# EAGLE design Power Dist Motor (EAGLE 7.2.0)
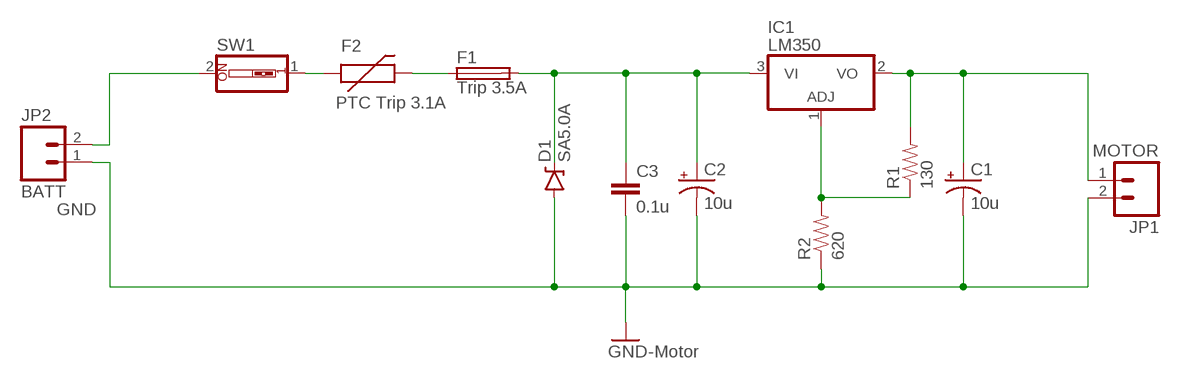
[diagram p0: schematic, sheet 1]

## Parts
C1  10u  CAP_POLPTH2  [CPOL-RADIAL-10UF-25V]
C2  10u  CAP_POLPTH2  [CPOL-RADIAL-10UF-25V]
C3  0.1u  CAPPTH  [CAP-PTH-SMALL]
D1  SA5.0A  DIODE-ZENER  [DIODE-BZT52]
F1  Trip 3.5A  PICOFUSE  [PICOFUSE]
F2  PTC Trip 3.1A  PTCPTH  [PTC]
IC1  LM350  317T  [TO220H]
JP1  MOTOR  M02PTH  [1X02]
JP2  BATT  M02PTH  [1X02]
R1  130  RESISTORPTH-1/4W  [AXIAL-0.4]
R2  620  RESISTORPTH-1/4W  [AXIAL-0.4]
SW1  SW_DIP-1  [EDG-01]

## Nets
GND: C1.2(-) C2.2(-) C3.2 D1.A JP1.2 JP2.1 R2.P$1 ; supply symbol labelled GND-Motor
N$1: C1.1(+) IC1.2(VO) JP1.1 R1.P$2
N$2: JP2.2 SW1.2
N$3: F2.P$1 SW1.1
N$4: IC1.1(ADJ) R1.P$1 R2.P$2
N$5: F1.1 F2.P$2
N$7: C2.1(+) C3.1 D1.C F1.2 IC1.3(VI)

## Library data of the parts
C1 C2 = SparkFun-Capacitors:CAP_POL: Capacitor Polarized These are standard SMD and PTH capacitors. Normally 10uF, 47uF, and 100uF in electrolytic and tantalum varieties. Always verify the external diameter of the through hole cap, it varies with capacity, voltage, and manufacturer. The EIA devices should be standard.
C3 = SparkFun-Capacitors:CAP: Capacitor Standard 0603 ceramic capacitor, and 0.1" leaded capacitor.
D1 = SparkFun-DiscreteSemi:DIODE-ZENER: Zener Diode Production Part - 8199 3.4V Zener Voltage; PROD-ID: DIO-08199; VALUE: BZT52
F1 = fuse:PICOFUSE: PICOFUSE 19275, Wickmann; OC_FARNELL: unknown; OC_NEWARK: unknown
F2 = SparkFun-PowerIC:PTC: Resettable Fuse PTC Resettable Fuse. Spark Fun Electronics SKU : COM-08357
IC1 = linear:*317: Positive VOLTAGE REGULATOR
JP1 JP2 = SparkFun-Connectors:M02: Standard 2-pin 0.1" header. Use with - straight break away headers ( PRT-00116) - right angle break away headers (PRT-00553) - swiss pins (PRT-00743) - machine pins (PRT-00117) - female headers (PRT-00115) Molex polarized connector foot print use with: PRT-08233 with associated crimp pins and housings. 2.54_SCREWTERM for use with PRT-10571. 3.5mm Screw Terminal footprints for PRT-08084 5mm Screw Terminal footprints for use with PRT-08432
R1 R2 = SparkFun-Passives:RESISTOR: Resistor Basic schematic elements and footprints for 0603, 1206, and PTH resistors.
SW1 = special:SW_DIP-1: DIP SWITCH

## Net classes
0 default: width 0.889 mm

## Board
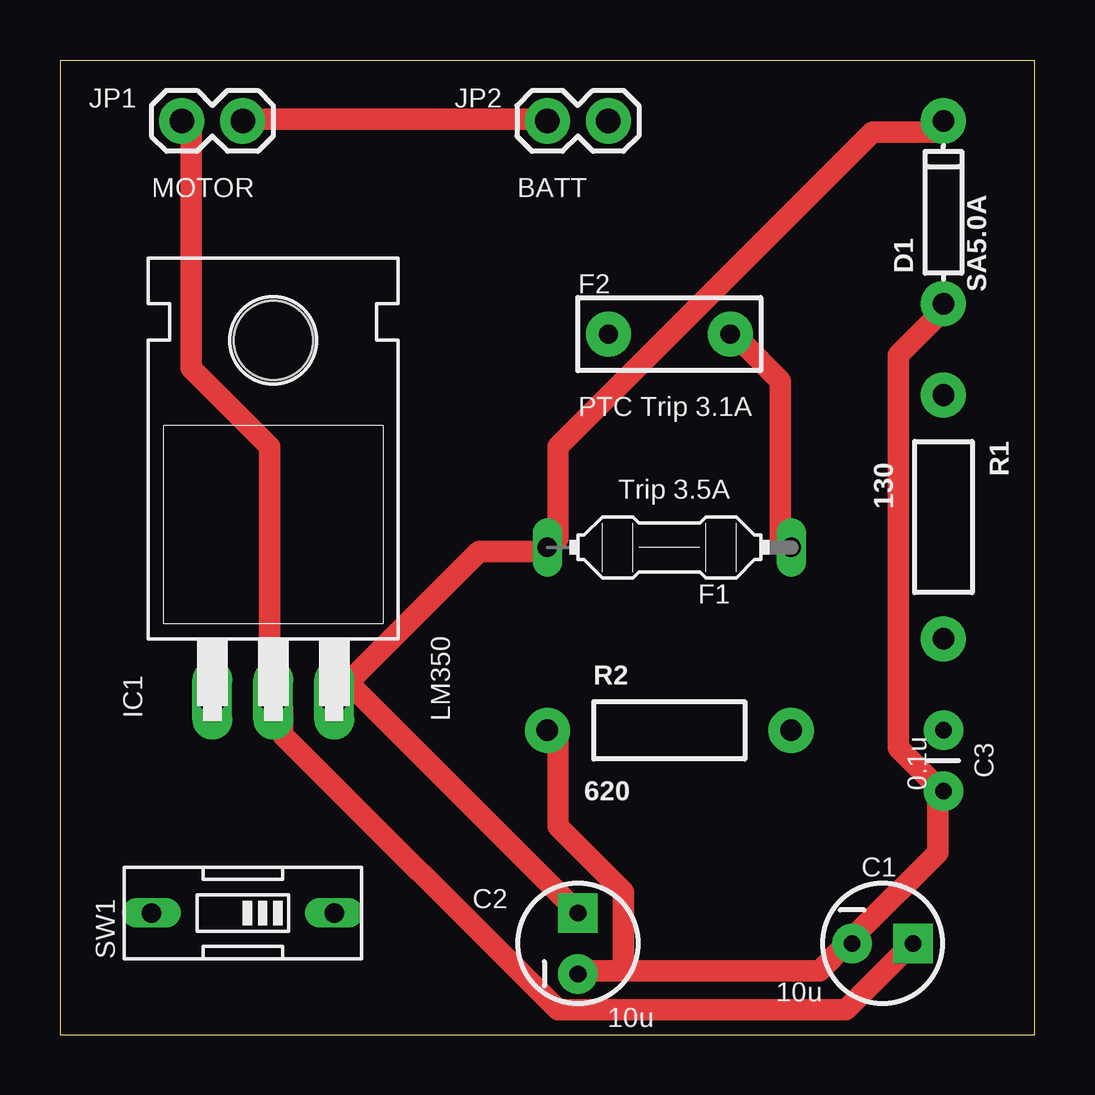
[diagram p1: board, top side]
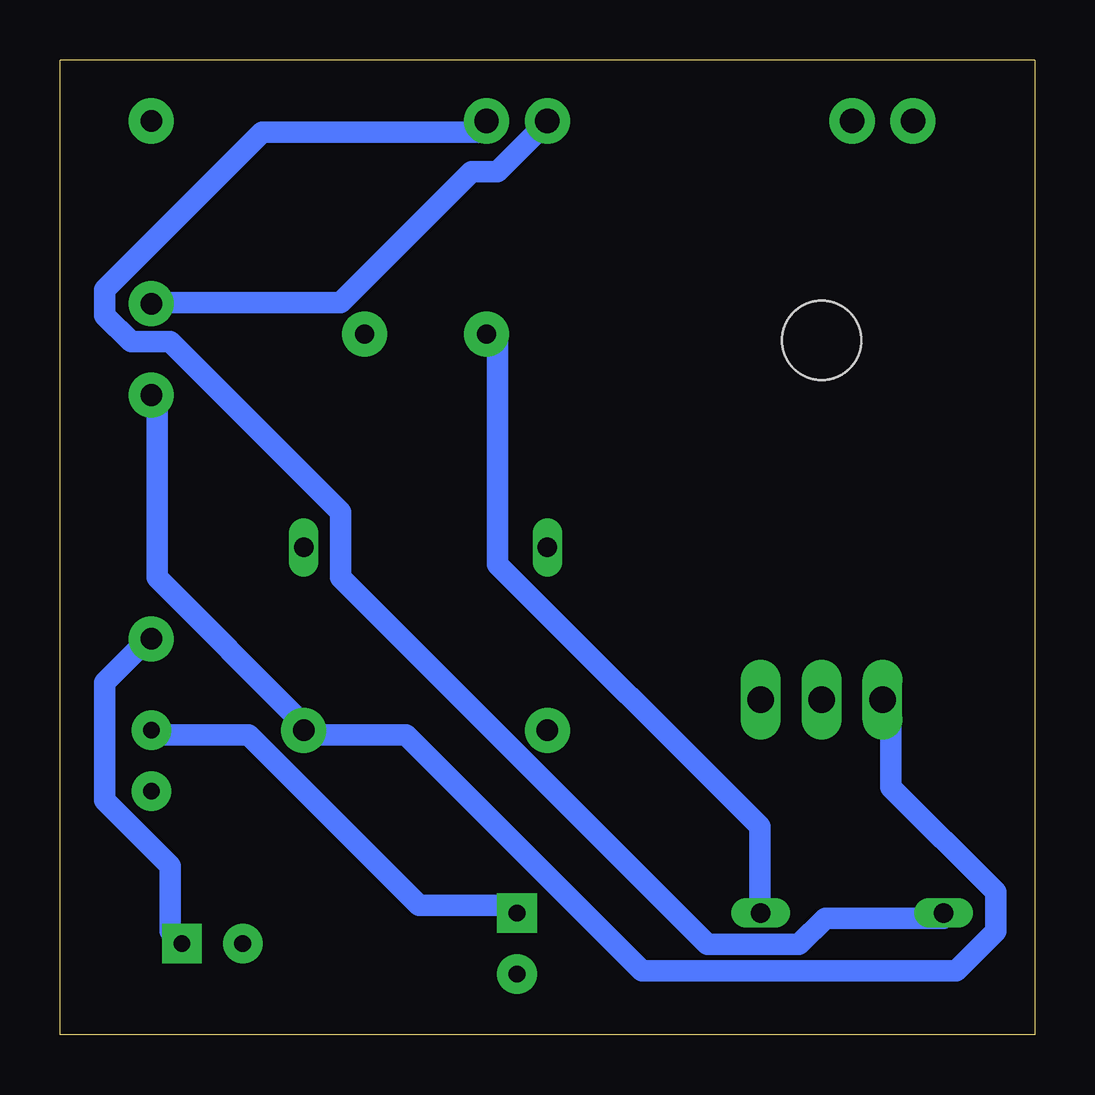
[diagram p2: board, bottom side, seen from below]

Size 40.64 x 40.64 mm. Coordinates in mm from the lower left corner, seen from the top.
Outline: 0,40.64 0,0 40.64,0 40.64,40.64 0,40.64
Copper layers (1*16): Top 0.0356mm / dielectric 1.5011mm / Bottom 0.0356mm
Design rules "LaenPCBOrder": minimum track width 6mil, minimum drill 13mil, track to track 6mil, track to pad 6mil, pad to pad 6mil, via to via 6mil, smd to smd 6mil, copper to edge 15mil, drill to drill 6mil, minimum pad ring 7mil, minimum via ring 7mil, stop-mask expansion 3mil, vias tented up to drill 0mil, thermal gap 10mil

### Footprints (pad centres in the part's own frame; a part is rotated, then mirrored left to right if it is on the bottom)
CPOL-RADIAL-10UF-25V = drill 0.7 pad 1.651 square: 1 1.27,0 | drill 0.7 pad 1.651: 2 -1.27,0
CAP-PTH-SMALL = drill 0.7 pad 1.651: 1 0,0; 2 2.54,0
DIODE-BZT52 = drill 0.9 pad 1.88: A -3.81,0; C 3.81,0
PICOFUSE = drill 0.813 long: 1 -5.08,0; 2 5.08,0
PTC = drill 0.8 pad 1.88: P$1 -2.54,0; P$2 2.54,0
TO220H = drill 1.118 long: 1 -2.54,-10.16; 2 0,-10.16; 3 2.54,-10.16 | hole 3.302: 0,4.826
1X02 = drill 1.016 pad 1.88: 1 0,0; 2 2.54,0
AXIAL-0.4 = drill 0.9 pad 1.88: P$1 -5.08,0; P$2 5.08,0
EDG-01 = drill 0.813 long: 1 0,-3.81; 2 0,3.81

### Placement (x,y rotation side)
C1  34.29,3.81 0 top
C2  21.59,3.81 90 top
C3  36.83,12.7 270 top
D1  36.83,34.29 90 top
F1  25.4,20.32 180 top
F2  25.4,29.21 0 top
IC1  8.89,24.13 0 top
JP1  5.08,38.1 0 top
JP2  20.32,38.1 0 top
R1  36.83,21.59 270 top
R2  25.4,12.7 0 top
SW1  7.62,5.08 90 top

### Tracks (layer width: path | path; a pad name or v marks a point on that pad's centre or on a via)
GND
  Top 0.889: 23.48,2.68 31.67,2.68 32.77,3.77 C1.2 33.31,4.32 36.59,7.6 36.59,9.78 C3.2 36.59,10.33 34.95,11.96 34.95,28.35 36.59,29.99 D1.A | 23.48,2.68 21.84,2.68 C2.2 | 23.48,2.68 23.48,5.96 20.75,8.69 20.75,12.51 R2.P$1 | JP1.2 7.64,38.18 20.21,38.18 JP2.1
  Bottom 0.889: D1.A 36.59,30.53 28.94,30.53 23.48,35.99 22.39,35.99 20.75,37.63 JP2.1
N$1
  Top 0.889: JP1.1 5.46,37.63 5.46,27.8 8.74,24.52 8.74,14.15 IC1.2 9.28,13.6 9.28,12.51 20.75,1.04 32.77,1.04 35.5,3.77 C1.1
  Bottom 0.889: C1.1 36.04,4.32 36.04,7.05 38.77,9.78 38.77,14.69 37.13,16.33 R1.P$2
N$2
  Bottom 0.889: SW1.2 3.82,4.86 8.74,4.86 9.83,3.77 13.65,3.77 28.94,19.06 28.94,21.79 36.04,28.89 37.68,28.89 38.77,29.99 38.77,31.08 32.22,37.63 22.94,37.63 JP2.2
N$3
  Bottom 0.889: SW1.1 11.47,5.41 11.47,8.69 22.39,19.61 22.39,28.89 F2.P$1
N$4
  Bottom 0.889: IC1.1 6.01,13.6 6.01,10.33 1.64,5.96 1.64,4.32 3.28,2.68 16.38,2.68 26.21,12.51 30.04,12.51 R2.P$2 30.58,13.06 36.59,19.06 36.59,26.16 R1.P$1
N$5
  Top 0.889: F1.1 30.04,20.7 30.04,27.25 28.4,28.89 F2.P$2
N$7
  Top 0.889: 12.01,14.69 11.47,14.15 IC1.3 12.01,14.69 | 12.01,14.69 17.48,20.16 20.21,20.16 F1.2 20.75,20.7 20.75,24.52 33.86,37.63 36.59,37.63 D1.C | 12.01,14.69 21.3,5.41 C2.1
  Bottom 0.889: C3.1 36.59,12.51 32.77,12.51 25.67,5.41 21.84,5.41 C2.1